# EAGLE design BUZZER (EAGLE 9.5.2)
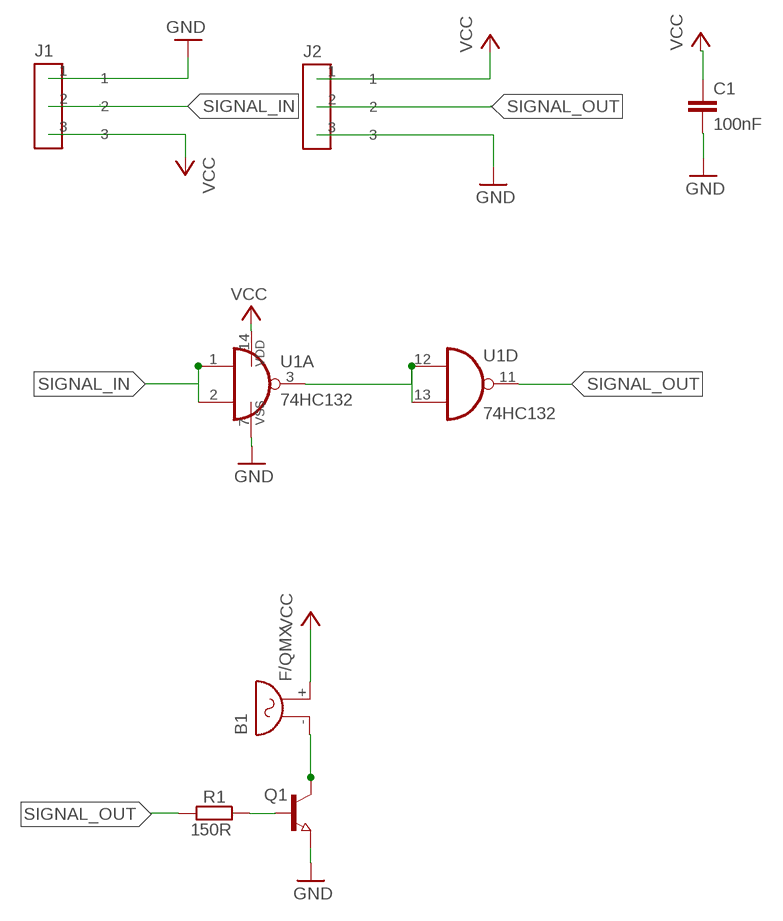
[diagram p0: schematic, sheet 1]

## Parts
B1  F/QMX  [F/QMX]
C1  100nF  C-EUC0805  [C0805]
J1  CONECTOR_IN  [3CONECTOR]
J2  CONECTOR  [3CONECTOR]
Q1  BC817  NPN-TRANSISTOR_SOT23  [SOT23]
R1  150R  R-EU_R0805W  [R0805W]
U1  74HC132  4011D  [SO14]

## Nets
GND: C1.2 J1.1 J2.3 Q1.2(E) U1.7(P:VSS)
N$1: U1.3(A:O) U1.12(D:I0) U1.13(D:I1)
N$2: Q1.1(B) R1.1
N$4: B1.- Q1.3(C)
SIGNAL_IN: J1.2 U1.1(A:I0) U1.2(A:I1)
SIGNAL_OUT: J2.2 R1.2 U1.11(D:O)
VCC: B1.+ C1.1 J1.3 J2.1 U1.14(P:VDD)
Unconnected: U1.4(B:O) U1.5(B:I0) U1.6(B:I1) U1.8(C:I0) U1.9(C:I1) U1.10(C:O)

## Library data of the parts
B1 = buzzer:F/QMX: BUZZER Source: Buerklin; OC_FARNELL: unknown; OC_NEWARK: unknown
C1 = rcl:C-EU: CAPACITOR, European symbol; SPICEPREFIX: C
J1 = Eletroblocks Lib:CONECTOR_IN
J2 = Eletroblocks Lib:CONECTOR
Q1 = semicon-smd-ipc:NPN-TRANSISTOR_: NPN TRANSISTOR
R1 = rcl:R-EU_: RESISTOR, European symbol; SPICEPREFIX: R
U1 = 40xx:4011: Quad 2-input NAND

## Board
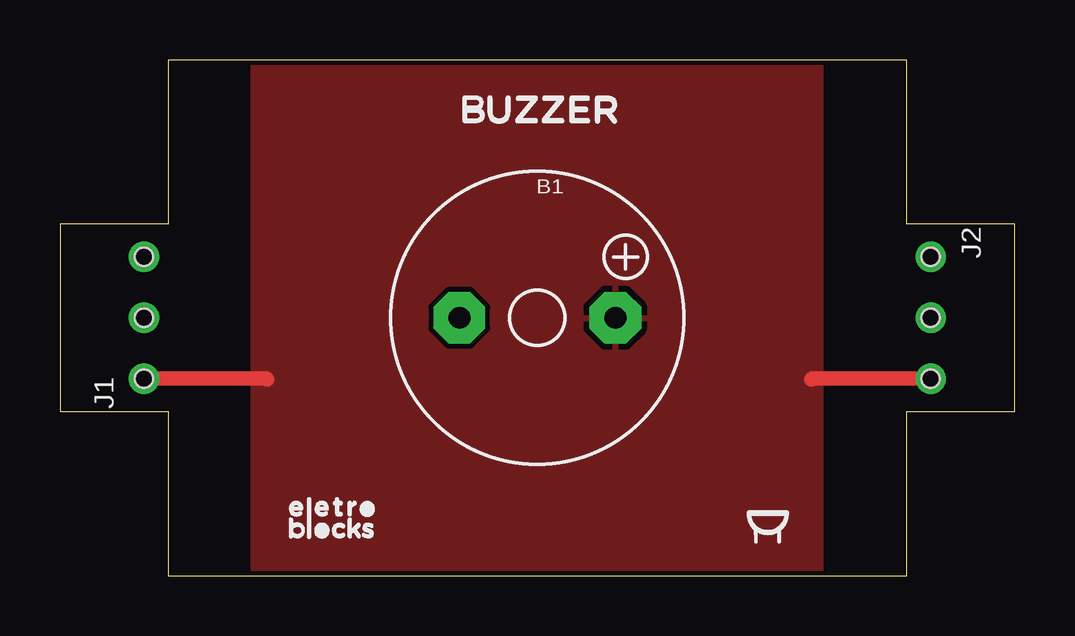
[diagram p1: board, top side]
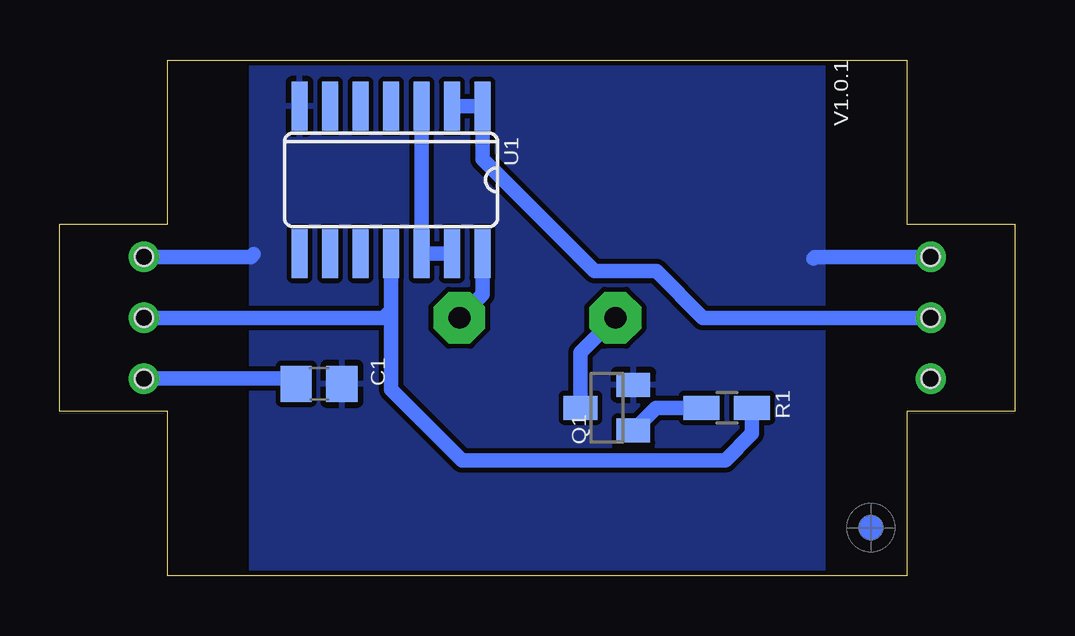
[diagram p2: board, bottom side, seen from below]

Size 39.8 x 21.5 mm. Coordinates in mm from the lower left corner, seen from the top.
Outline: 4.5,0 35.3,0 35.3,6.85 39.8,6.85 39.8,14.65 35.3,14.65 35.3,21.5 4.5,21.5 4.5,14.65 0,14.65 0,6.85 4.5,6.85 4.5,0
Copper layers (1*16): Top 0.035mm / dielectric 1.5mm / Bottom 0.035mm
Design rules "default *": minimum track width 8mil, minimum drill 0.35mm, track to track 8mil, track to pad 8mil, pad to pad 8mil, via to via 8mil, smd to smd 8mil, copper to edge 8mil, drill to drill 8mil, minimum pad ring 10mil, minimum via ring 8mil, stop-mask expansion 4mil, vias tented up to drill 0mil, thermal gap 10mil

### Footprints (pad centres in the part's own frame; a part is rotated, then mirrored left to right if it is on the bottom)
F/QMX = drill 0.914 pad 2.159 octagon: + 3.251,0; - -3.251,0
C0805 = smd 1.3 x 1.5: 1 -0.95,0; 2 0.95,0
3CONECTOR = drill 0.75: 1 0,2.54; 2 0,0; 3 0,-2.54 | hole 0.75: 0,2.54; 0,0; 0,-2.54
SOT23 = smd 1 x 1.4: 1 -0.95,-1.1; 2 0.95,-1.1; 3 0,1.1
R0805W = smd 1.5 x 1: 1 -1.052,0; 2 1.052,0
SO14 = smd 0.66 x 2.032: 1 -3.81,-3.073; 2 -2.54,-3.073; 3 -1.27,-3.073; 4 0,-3.073; 5 1.27,-3.073; 6 2.54,-3.073; 7 3.81,-3.073; 8 3.81,3.073; 9 2.54,3.073; 10 1.27,3.073; 11 0,3.073; 12 -1.27,3.073; 13 -2.54,3.073; 14 -3.81,3.073

### Placement (x,y rotation side)
B1  19.9,10.75 0 top
C1  29,8 0 bottom
J1  CONECTOR_MACHO  [3CONECTOR]  3.5,10.75 0 top
J2  CONECTOR_FEMEA  [3CONECTOR]  36.3,10.75 180 top
Q1  17,7 90 bottom
R1  12,7 0 bottom
U1  26,16.5 180 bottom
U$1  [FIDUCIAL_G10]  6,2 0 bottom

### Tracks (layer width: path | path; a pad name or v marks a point on that pad's centre or on a via)
GND
  Bottom 0.61: J1.1 8.33,13.29 8.39,13.23 | J2.3 31.84,13.29 31.72,13.41
  pour Bottom: 8,0 31.8,0 31.8,21.5 8,21.5
N$1
  Bottom 0.61: U1.3 U1.12 U1.13
N$2
  Bottom 0.61: R1.1 14.95,7 Q1.1
N$4
  Bottom 0.61: B1.- 18.1,9.3 Q1.3
SIGNAL_IN
  Bottom 0.61: J1.2 12.99,10.75 14.93,12.69 17.52,12.69 22.19,17.36 U1.1 U1.2
SIGNAL_OUT
  Bottom 0.61: U1.11 26,11.06 | 26,11.06 26,7.76 23.04,4.8 12.07,4.8 10.95,5.92 R1.2 | J2.2 26.31,10.75 26,11.06
VCC
  Top 0.61: J1.3 8.6,8.21 8.63,8.18 | J2.1 31.36,8.21 31.33,8.18
  Bottom 0.61: J2.1 30.16,8.21 C1.1 | U1.14 22.19,11.71 B1.+
  pour Top: 8,0 8,21.48 31.76,21.48 31.76,0.15 31.86,0.05 8.05,0.05

### Text on the board
bPlace: V1.0.1